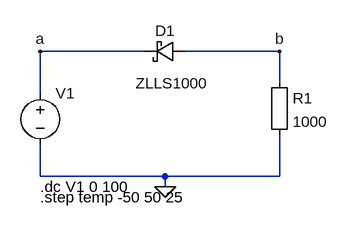
[diagram p0: schematic diode-va-reverse-100.asc]
diode-va-reverse-100.asc, the LTspice schematic file:
Version 4
SHEET 1 880 680
WIRE 16 160 -144 160
WIRE 224 160 80 160
WIRE 224 208 224 160
WIRE -144 224 -144 160
WIRE -144 352 -144 304
WIRE 48 352 -144 352
WIRE 224 352 224 288
WIRE 224 352 48 352
WIRE 48 368 48 352
FLAG -144 160 a
FLAG 224 160 b
FLAG 48 368 0
SYMBOL schottky 80 144 R90
WINDOW 0 0 32 VBottom 2
WINDOW 3 49 21 VTop 2
SYMATTR InstName D1
SYMATTR Value ZLLS1000
SYMATTR Description Diode
SYMATTR Type diode
SYMBOL Misc\\EuropeanResistor 208 192 R0
SYMATTR InstName R1
SYMATTR Value 1000
SYMBOL voltage -144 208 R0
SYMATTR InstName V1
SYMATTR Value ""
TEXT -144 368 Left 2 !.dc V1 0 100
TEXT -144 384 Left 2 !.step temp -50 50 25

The netlist it stands for:
* diode-va-reverse-100.asc
D1 b a ZLLS1000
R1 b 0 1000
V1 a 0
.model D D
.lib standard.dio
.dc V1 0 100
.step temp -50 50 25
.backanno
.end